# Altium project 工控主板.PrjPcb
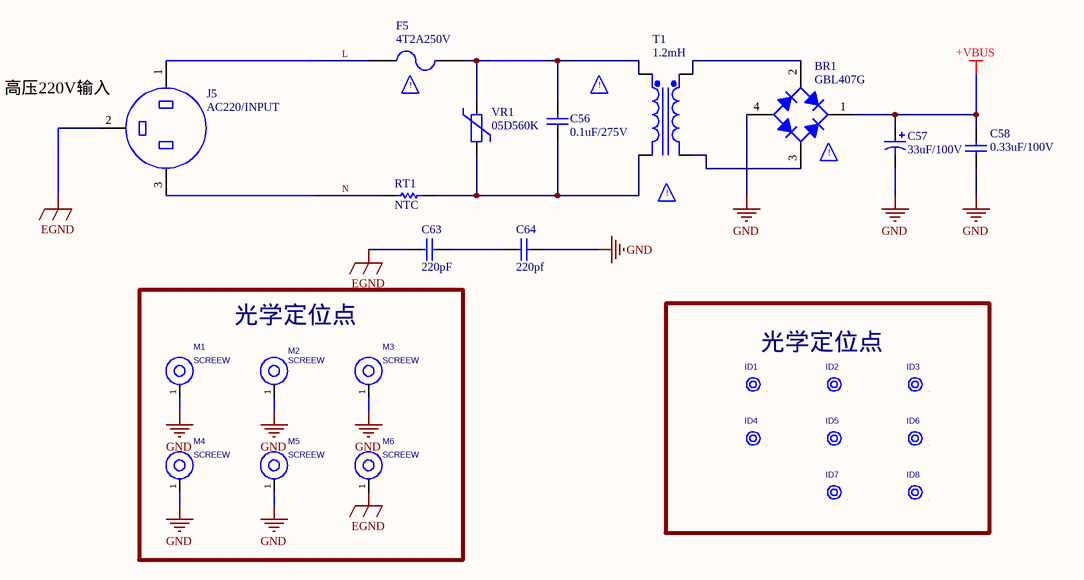
[diagram p0: 01-POWER AC-DC.SchDoc]
5 sheets, 163 parts. Net scope: global (net labels, ports and power ports of the same name join across sheets).
Board file: 工控主板.PcbDoc
Sheets:
  01-POWER AC-DC.SchDoc
  02-POWER DC-DC.SchDoc
  03-CPU Core.SchDoc
  04-lnterface1.SchDoc
  05-lnterface2.SchDoc

## Sheet 01-POWER AC-DC.SchDoc
size A4; SheetNumber: 2; SheetTotal: 6; SPICEModelCacheOUJAJSNC: <root> / <DocumentId>OUJAJSNC</DocumentId> / </root>

### Parts
BR1  GBL407G  [GBL407G]
C56  value 0.1uF/275V  [CBB62-275VAC-104K]  (hidden comment: Cap)
C57  33uF/100V  [CE16250SH1]
C58  value 0.33uF/100V  [AF334J1J079L270D9H]  (hidden comment: Cap)
C63  value 220pF  [C0805]  (hidden comment: Cap)
C64  value 220pf  [C0805]  (hidden comment: Cap)
F5  Fuse 2  [4T2A250V]  (value not drawn)
ID1  LOC  [MARK_1]  (value not drawn)
ID2  LOC  [MARK_1]  (value not drawn)
ID3  LOC  [MARK_1]  (value not drawn)
ID4  LOC  [MARK_1]  (value not drawn)
ID5  LOC  [MARK_1]  (value not drawn)
ID6  LOC  [MARK_1]  (value not drawn)
ID7  LOC  [MARK_1]  (value not drawn)
ID8  LOC  [MARK_1]  (value not drawn)
J5  AC220/INPUT  [VH-3A]
M1  value SCREEW  [SCREEW]  (hidden comment: MARK_4)
M2  value SCREEW  [SCREEW]  (hidden comment: MARK_4)
M3  value SCREEW  [SCREEW]  (hidden comment: MARK_4)
M4  value SCREEW  [SCREEW]  (hidden comment: MARK_4)
M5  value SCREEW  [SCREEW]  (hidden comment: MARK_4)
M6  value SCREEW  [SCREEW]  (hidden comment: MARK_4)
RT1  NTC  [NTC-10D9]
T1  1.2mH  [UU1014]
VR1  05D560K  [RUEF400]

### Blocks framed on the sheet
光学定位点: M1-M6
光学定位点: ID1-ID8

### Nets
+VBUS: BR1.1(K) C57.1 C58.2
EGND: C63.1 J5.2 M6.1
GND: BR1.4(A) C57.2 C58.1 C64.2 M1.1 M2.1 M3.1 M4.1 M5.1  [project net +5V]
L: F5.1 J5.1
N: J5.3 RT1.1
NetBR1_2: BR1.2(C) T1.3(Sec+)
NetBR1_3: BR1.3(C) T1.4(Sec-)
NetC56_1: C56.1 F5.2 T1.1(Pri+) VR1.2
NetC56_2: C56.2 RT1.2 T1.2(Pri-) VR1.1
NetC63_2: C63.2 C64.1

Not connected (* = marked no-connect by the designer): ID1 1; ID2 1; ID3 1; ID4 1; ID5 1; ID6 1; ID7 1; ID8 1

### Notes on the sheet
- (near J5) 高压220V输入
- (near F5) !
- !
- (near T1) !
- (near BR1) !
- (in symbol Fuse 2) 4T2A250V

### Library data of the parts
BR1 = Bridge1: Full Wave Diode Bridge; Published: 8-Jun-2000; LatestRevisionDate: 17-Jul-2002; LatestRevisionNote: Re-released for DXP Platform.; Publisher: Altium Limited
C56 C58 C63 C64 = Cap: Capacitor; Published: 8-Jun-2000; LatestRevisionDate: 17-Jul-2002; LatestRevisionNote: Re-released for DXP Platform.; Publisher: Altium Limited
C57 = Cap Pol1: Polarized Capacitor (Radial); Published: 8-Jun-2000; LatestRevisionDate: 17-Jul-2002; LatestRevisionNote: Re-released for DXP Platform.; Publisher: Altium Limited; Value: 33uF/100V
F5 = Fuse 2: Fuse; Published: 8-Jun-2000; LatestRevisionDate: 17-Jul-2002; LatestRevisionNote: Re-released for DXP Platform.; Publisher: Altium Limited
ID1-ID8 = LOC: SMT_Locotion; PCB DECAL: MARK
M1-M6 = MARK_4: MARK Symble; RK_PN: MARK01; Priority: A; Created_by: CZD; Source_Path: C:\USERS\STQ\DESKTOP\RK3399_BOX\RK3399_BOX_SCH_V1.0_20180521.DSN; Part_Type: MARK; PCB DECAL: MARK
RT1 = Res1: Resistor; Value: 1K; Published: 8-Jun-2000; LatestRevisionDate: 17-Jul-2002; LatestRevisionNote: Re-released for DXP Platform.; Publisher: Altium Limited
T1 = Trans Eq: Transformer (Equivalent Circuit Model); Published: 8-Jun-2000; LatestRevisionDate: 17-Jul-2002; LatestRevisionNote: Re-released for DXP Platform.; Publisher: Altium Limited
VR1 = VR 561K

## Sheet 02-POWER DC-DC.SchDoc
size A4; SheetNumber: 3; SheetTotal: 6; SPICEModelCacheXRWPUVAV: <root> / <DocumentId>XRWPUVAV</DocumentId> / </root>
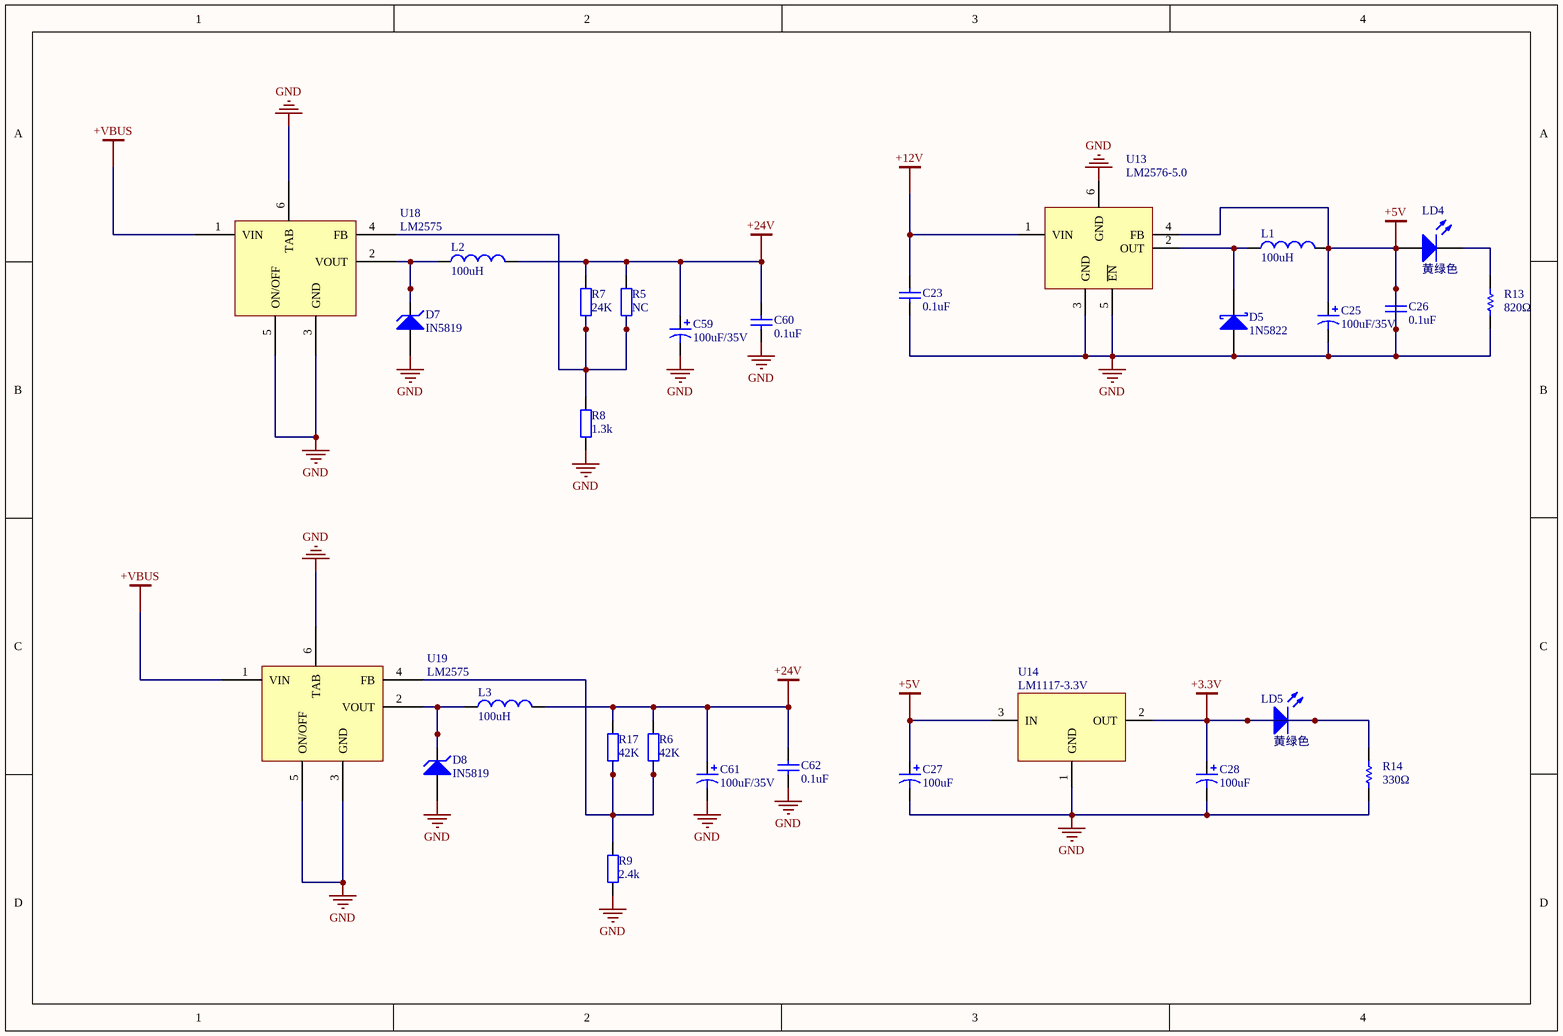
[diagram p1: 02-POWER DC-DC.SchDoc]

### Parts
C23  value 0.1uF  [C0805]  (hidden comment: Cap)
C25  value 100uF/35V  [SMD-6.3-7.7]  (hidden comment: Cap Pol2)
C26  value 0.1uF  [C0805]  (hidden comment: Cap)
C27  value 100uF  [SMD-6.3-7.7]  (hidden comment: Cap Pol2)
C28  value 100uF  [SMD-6.3-7.7]  (hidden comment: Cap Pol2)
C59  value 100uF/35V  [SMD-6.3-7.7]  (hidden comment: Cap Pol2)
C60  value 0.1uF  [C0805]  (hidden comment: Cap)
C61  value 100uF/35V  [SMD-6.3-7.7]  (hidden comment: Cap Pol2)
C62  value 0.1uF  [C0805]  (hidden comment: Cap)
D5  1N5822  [SMA-L4]
D7  IN5819  [SMA-L4]
D8  IN5819  [SMA-L4]
L1  value 100uH  [L100uH]  (hidden comment: Inductor)
L2  value 100uH  [L100uH]  (hidden comment: Inductor)
L3  value 100uH  [L100uH]  (hidden comment: Inductor)
LD4  黄绿色  [LED0805]
LD5  黄绿色  [LED0805]
R5  value NC  [R0805]  (hidden comment: Res2)
R6  value 42K  [R0805]  (hidden comment: Res2)
R7  value 24K  [R0805]  (hidden comment: Res2)
R8  value 1.3k  [R0805]  (hidden comment: Res2)
R9  value 2.4k  [R0805]  (hidden comment: Res2)
R13  value 820Ω  [NTC-10D9]
R14  value 330Ω  [NTC-10D9]
R17  value 42K  [R0805]  (hidden comment: Res2)
U13  LM2576-5.0  [TO-263-5]
U14  LM1117-3.3V  [SOT-223]
U18  LM2575  [TO-263-5]
U19  LM2575  [TO-263-5]

### Nets
+3.3V: C28.1 LD5.1(A) LD5.2(K) R14.2 U14.2(OUT)
+5V: C23.1 C25.1 C25.2 C26.1 C26.2 C27.1 C27.2 C28.2 C59.2 C60.1 C61.2 C62.1 D5.2(A) D7.1(A) D8.1(A) L1.2 LD4.1(A) R8.2 R9.2 R13.1 R14.1 U13.3(GND) U13.4(FB) U13.5(~{EN}) U13.6(GND) U14.1(GND) U14.3(IN) U18.3(GND) U18.5(ON/OFF) U18.6(TAB) U19.3(GND) U19.5(ON/OFF) U19.6(TAB)  [also labelled GND]
+12V: C23.2 U13.1(VIN)
+24V: C59.1 C60.2 C61.1 C62.2 L2.2 L3.2 R5.1 R6.1 R7.2 R17.2
+VBUS: U18.1(VIN) U19.1(VIN)
NetD5_1: D5.1(K) L1.1 U13.2(OUT)
NetD7_2: D7.2(K) L2.1 U18.2(VOUT)
NetD8_2: D8.2(K) L3.1 U19.2(VOUT)
NetLD4_2: LD4.2(K) R13.2
NetR5_2: R5.2 R7.1 R8.1 U18.4(FB)
NetR6_2: R6.2 R9.1 R17.1 U19.4(FB)

### Library data of the parts
C23 C26 C60 C62 = Cap: Capacitor; Published: 8-Jun-2000; LatestRevisionDate: 17-Jul-2002; LatestRevisionNote: Re-released for DXP Platform.; Publisher: Altium Limited
C25 C27 C28 C59 C61 = Cap Pol2: Polarized Capacitor (Axial); Published: 8-Jun-2000; LatestRevisionDate: 17-Jul-2002; LatestRevisionNote: Re-released for DXP Platform.; PackageReference: POLAR0.8; Publisher: Altium Limited; PackageDescription: Polarized Capacitor; 2 Leads
D5 = Diode 10TQ035: Schottky Rectifier; Note: Terminal 2 is the TAB and is electrically connected to the cathode; Published: 8-Jun-2000; LatestRevisionDate: 17-Jul-2002; LatestRevisionNote: Re-released for DXP Platform.; DatasheetDocument: PD-2.057B; PackageDocument: Feb-1998; PackageReference: TO-220AC; Publisher: Altium Limited
D7 D8 = D Zener: Zener Diode; Published: 8-Jun-2000; LatestRevisionDate: 17-Jul-2002; LatestRevisionNote: Re-released for DXP Platform.; PackageReference: DIODE-0.7; Publisher: Altium Limited; PackageDescription: Diode, Thru-Hole; 2 Leads; 0.7 in Pin Spacing
L1-L3 = Inductor: Code_IEC: 1005; Published: 8-Jun-2000; LatestRevisionDate: 17-Jul-2002; LatestRevisionNote: Re-released for DXP Platform.; PackageReference: 0402-A; Publisher: Altium Limited; Code_JEITA: 0402
LD4 LD5 = LED0: Typical INFRARED GaAs LED; Published: 8-Jun-2000; LatestRevisionDate: 17-Jul-2002; LatestRevisionNote: Re-released for DXP Platform.; Publisher: Altium Limited
R5-R9 R17 = Res2: Resistor; Published: 8-Jun-2000; LatestRevisionDate: 17-Jul-2002; LatestRevisionNote: Re-released for DXP Platform.; PackageReference: AXIAL-0.4; Publisher: Altium Limited; PackageDescription: Axial Device, Thru-Hole; 2 Leads; 0.4 in Pin Spacing
R13 R14 = Res1: Resistor; Published: 8-Jun-2000; LatestRevisionDate: 17-Jul-2002; LatestRevisionNote: Re-released for DXP Platform.; Publisher: Altium Limited
U14 = LM1117

## Sheet 03-CPU Core.SchDoc
size A2; SheetNumber: 4; SheetTotal: 6; SPICEModelCacheQEJGZIRO: <root> / <DocumentId>QEJGZIRO</DocumentId> / <CacheFrame Number="0"> / <Model Name="diode" Kind="MDL"> / <Text>*Default Diode / *Diode Pinout: A,K / .MODEL DIODE D()</Text> / </Model> / <Model Name="xtal" Kind="CKT"> / <Text>*Generic type:crystal pkg:HC33/51 / .SUBCKT XTAL 1 2 PARAMS: FREQ=1Meg RS=750 C=13pf Q=1000 / LX 1 3 {((Q*RS)/(6.2831852*FREQ))} IC=0.5M / CX 3 4 {(1/(Q*6.2831852*FREQ*RS))} / C0 1 2 {C} / RS 4 2 {RS} / .ENDS XTAL</Text> / </Model> / <Model Name="led0" Kind="MDL"> / <Text>*Typ INFRARED GaAs LED: Vf=1.2V Vr=5V If=40mA trr=3uS / *LED Pinout: 1=A, 2=K / .MODEL LED0 D (IS=93.5P RS=84M N=2.63 BV=5 IBV=10U / + CJO=2.97P VJ=.75 M=.333 TT=4.32U)</Text> / </Model> / </CacheFrame> / </root>
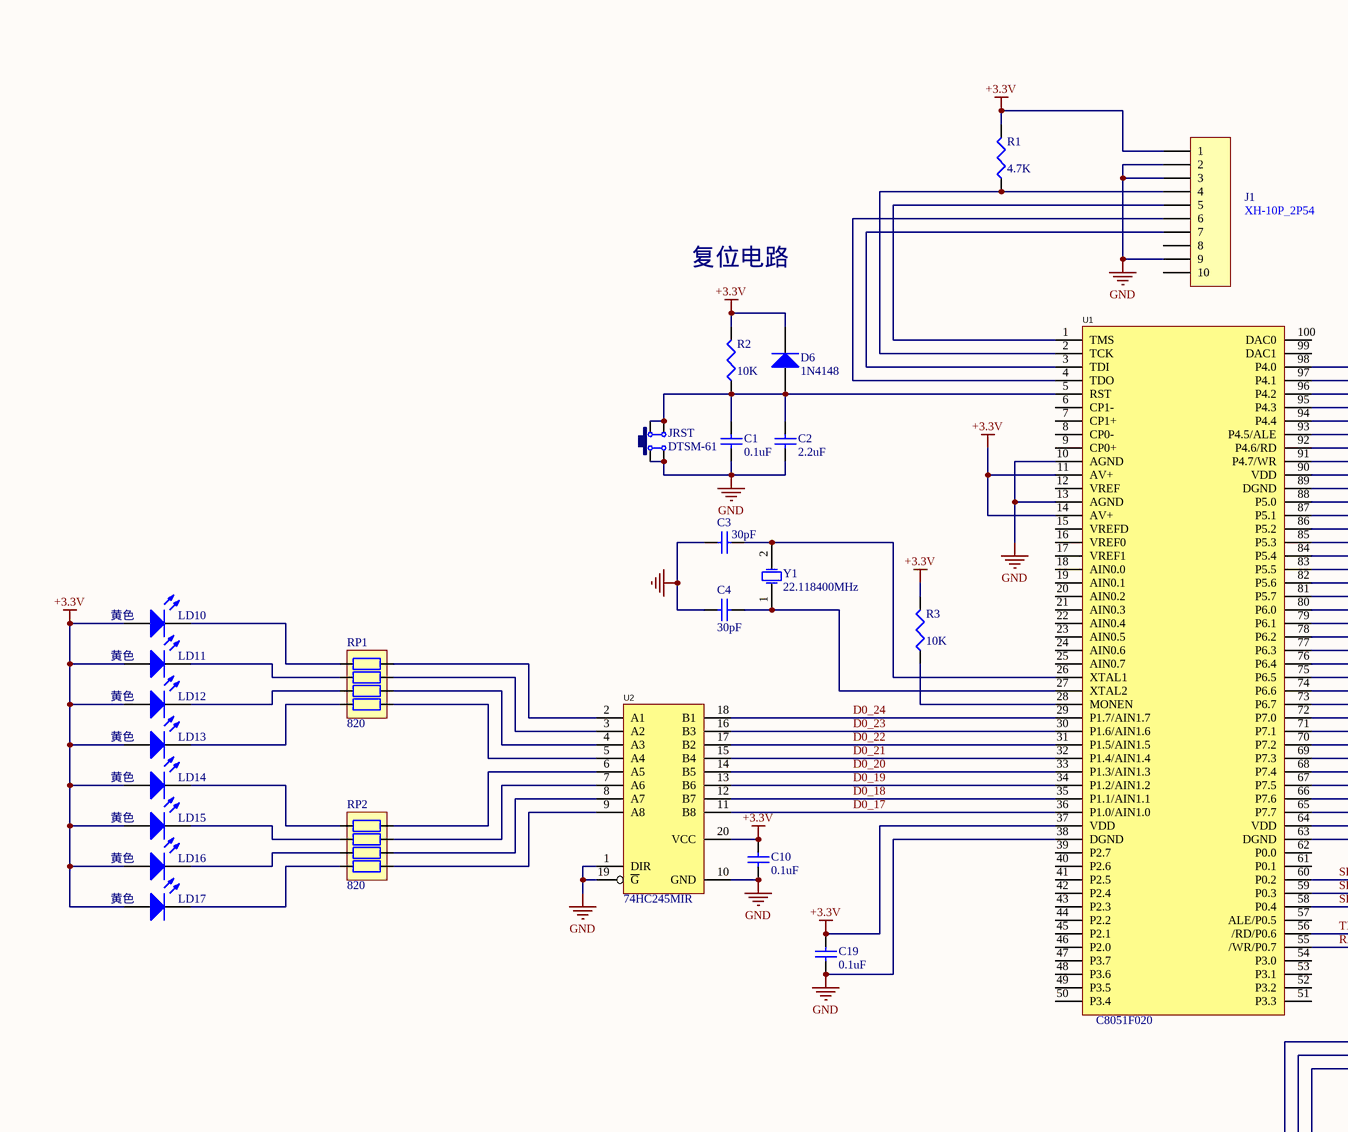
[diagram p2: 03-CPU Core.SchDoc, left]
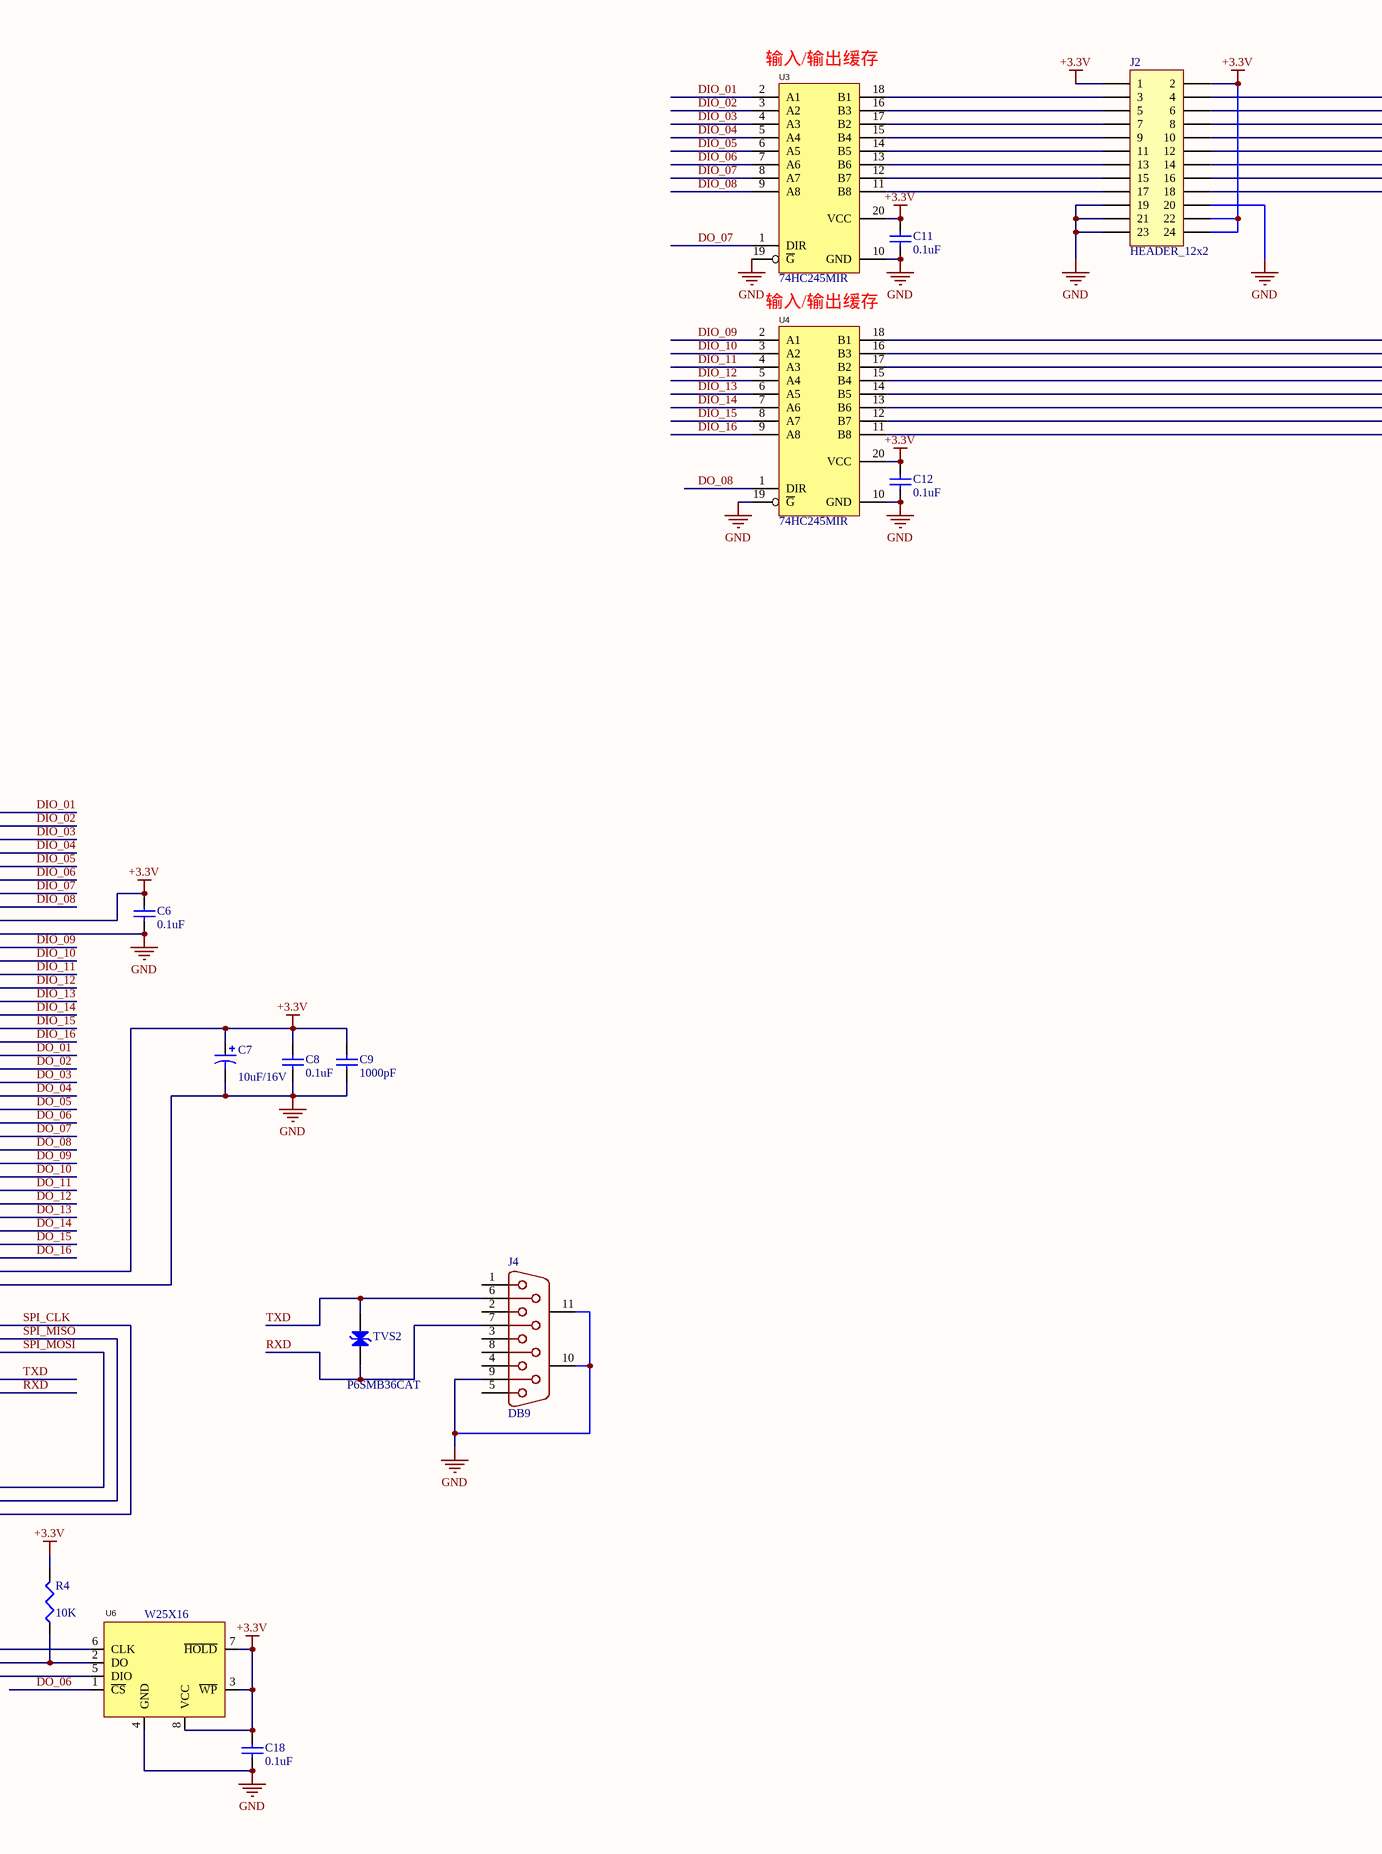
[diagram p3: 03-CPU Core.SchDoc, right]

### Parts
C1  value 0.1uF  [C0805]  (hidden comment: Cap)
C2  value 2.2uF  [C0805]  (hidden comment: Cap)
C3  value 30pF  [C0805]  (hidden comment: Cap)
C4  value 30pF  [C0805]  (hidden comment: Cap)
C6  value 0.1uF  [C0805]  (hidden comment: Cap)
C7  value 10uF/16V  [C3216]  (hidden comment: Cap Pol1)
C8  value 0.1uF  [C0805]  (hidden comment: Cap)
C9  value 1000pF  [C0805]  (hidden comment: Cap)
C10  value 0.1uF  [C0805]  (hidden comment: Cap)
C11  value 0.1uF  [C0805]  (hidden comment: Cap)
C12  value 0.1uF  [C0805]  (hidden comment: Cap)
C18  value 0.1uF  [C0805]  (hidden comment: Cap)
C19  value 0.1uF  [C0805]  (hidden comment: Cap)
D6  1N4148  [FR107W]
J1  XH-10P_2P54  [XH-10P_2P54]  (value not drawn)
J2  HEADER_12x2  [HEADER_12x2]
J4  DB9  [DB9]
JRST  DTSM-61  [DISM-61]
LD10  黄色  [LED0805]
LD11  黄色  [LED0805]
LD12  黄色  [LED0805]
LD13  黄色  [LED0805]
LD14  黄色  [LED0805]
LD15  黄色  [LED0805]
LD16  黄色  [LED0805]
LD17  黄色  [LED0805]
R1  value 4.7K  [R0805]  (hidden comment: Res3)
R2  value 10K  [R0805]  (hidden comment: Res3)
R3  value 10K  [R0805]  (hidden comment: Res3)
R4  value 10K  [R0805]  (hidden comment: Res3)
RP1  820  [RP]
RP2  820  [RP]
TVS2  P6SMB36CAT  [TVS]
U1  C8051F020  [TQFP-100]
U2  74HC245MIR  [SSOP-20]
U3  74HC245MIR  [SSOP-20]
U4  74HC245MIR  [SSOP-20]
U6  W25X16  [SOIC-8]
Y1  22.118400MHz  [HC-49]

### Nets
+3.3V: C6.2 C7.1 C8.2 C9.2 C10.2 C11.2 C12.2 C18.2 C19.2 D6.2(K) J1.1 J2.1 J2.2 J2.22 J2.24 LD10.1(A) LD11.1(A) LD12.1(A) LD13.1(A) LD14.1(A) LD15.1(A) LD16.1(A) LD17.1(A) R1.2 R2.2 R3.2 R4.2 U1.11(AV+) U1.14(AV+) U1.37(VDD) U1.64(VDD) U1.90(VDD) U2.20(VCC) U3.20(VCC) U4.20(VCC) U6.3(~{WP}) U6.7(~{HOLD}) U6.8(VCC)
GND: C1.2 C2.2 C3.1 C4.1 C6.1 C7.2 C8.1 C9.1 C10.1 C11.1 C12.1 C18.1 C19.1 J1.2 J1.3 J1.9 J2.19 J2.20 J2.21 J2.23 J4.9 J4.10(MH1) J4.11(MH2) JRST.1 JRST.4 U1.10(AGND) U1.13(AGND) U1.38(DGND) U1.63(DGND) U1.89(DGND) U2.1(DIR) U2.10(GND) U2.19(~{G}) U3.10(GND) U3.19(~{G}) U4.10(GND) U4.19(~{G}) U6.4(GND)  [project net +5V]
D0_17: U1.36(P1.0/AIN1.0) U2.11(B8)
D0_18: U1.35(P1.1/AIN1.1) U2.12(B7)
D0_19: U1.34(P1.2/AIN1.2) U2.13(B6)
D0_20: U1.33(P1.3/AIN1.3) U2.14(B5)
D0_21: U1.32(P1.4/AIN1.4) U2.15(B4)
D0_22: U1.31(P1.5/AIN1.5) U2.17(B2)
D0_23: U1.30(P1.6/AIN1.6) U2.16(B3)
D0_24: U1.29(P1.7/AIN1.7) U2.18(B1)
DIO_01: U1.98(P4.0) U3.2(A1)
DIO_02: U1.97(P4.1) U3.3(A2)
DIO_03: U1.96(P4.2) U3.4(A3)
DIO_04: U1.95(P4.3) U3.5(A4)
DIO_05: U1.94(P4.4) U3.6(A5)
DIO_06: U1.93(P4.5/ALE) U3.7(A6)
DIO_07: U1.92(P4.6/RD) U3.8(A7)
DIO_08: U1.91(P4.7/WR) U3.9(A8)
DIO_09: U1.88(P5.0) U4.2(A1)
DIO_10: U1.87(P5.1) U4.3(A2)
DIO_11: U1.86(P5.2) U4.4(A3)
DIO_12: U1.85(P5.3) U4.5(A4)
DIO_13: U1.84(P5.4) U4.6(A5)
DIO_14: U1.83(P5.5) U4.7(A6)
DIO_15: U1.82(P5.6) U4.8(A7)
DIO_16: U1.81(P5.7) U4.9(A8)
DO_01: U1.80(P6.0)
DO_02: U1.79(P6.1)
DO_03: U1.78(P6.2)
DO_04: U1.77(P6.3)
DO_05: U1.76(P6.4)
DO_06: U1.75(P6.5) U6.1(~{CS})
DO_07: U1.74(P6.6) U3.1(DIR)
DO_08: U1.73(P6.7) U4.1(DIR)
DO_09: U1.72(P7.0)
DO_10: U1.71(P7.1)
DO_11: U1.70(P7.2)
DO_12: U1.69(P7.3)
DO_13: U1.68(P7.4)
DO_14: U1.67(P7.5)
DO_15: U1.66(P7.6)
DO_16: U1.65(P7.7)
RXD: J4.7 TVS2.2(K) U1.55(/WR/P0.7)
SPI_CLK: U1.60(P0.2) U6.6(CLK)
SPI_MISO: R4.1 U1.59(P0.3) U6.2(DO)
SPI_MOSI: U1.58(P0.4) U6.5(DIO)
TXD: J4.6 TVS2.1(A) U1.56(/RD/P0.6)
NetC1_1: C1.1 C2.1 D6.1(A) JRST.2 JRST.3 R2.1 U1.5(RST)
NetC3_2: C3.2 U1.26(XTAL1) Y1.2(OSC2)
NetC4_2: C4.2 U1.27(XTAL2) Y1.1(OSC1)
NetJ1_4: J1.4 R1.1 U1.2(TCK)
NetJ1_5: J1.5 U1.1(TMS)
NetJ1_6: J1.6 U1.4(TDO)
NetJ1_7: J1.7 U1.3(TDI)
NetJ2_3: J2.3 U3.18(B1)
NetJ2_4: J2.4 U4.18(B1)
NetJ2_5: J2.5 U3.16(B3)
NetJ2_6: J2.6 U4.16(B3)
NetJ2_7: J2.7 U3.17(B2)
NetJ2_8: J2.8 U4.17(B2)
NetJ2_9: J2.9 U3.15(B4)
NetJ2_10: J2.10 U4.15(B4)
NetJ2_11: J2.11 U3.14(B5)
NetJ2_12: J2.12 U4.14(B5)
NetJ2_13: J2.13 U3.13(B6)
NetJ2_14: J2.14 U4.13(B6)
NetJ2_15: J2.15 U3.12(B7)
NetJ2_16: J2.16 U4.12(B7)
NetJ2_17: J2.17 U3.11(B8)
NetJ2_18: J2.18 U4.11(B8)
NetLD10_2: LD10.2(K) RP1.1
NetLD11_2: LD11.2(K) RP1.2
NetLD12_2: LD12.2(K) RP1.3
NetLD13_2: LD13.2(K) RP1.4
NetLD14_2: LD14.2(K) RP2.1
NetLD15_2: LD15.2(K) RP2.2
NetLD16_2: LD16.2(K) RP2.3
NetLD17_2: LD17.2(K) RP2.4
NetR3_1: R3.1 U1.28(MONEN)
NetRP1_5: RP1.5 U2.5(A4)
NetRP1_6: RP1.6 U2.4(A3)
NetRP1_7: RP1.7 U2.3(A2)
NetRP1_8: RP1.8 U2.2(A1)
NetRP2_5: RP2.5 U2.9(A8)
NetRP2_6: RP2.6 U2.8(A7)
NetRP2_7: RP2.7 U2.7(A6)
NetRP2_8: RP2.8 U2.6(A5)

Not connected (* = marked no-connect by the designer): J1 8 10; J4 1 2 3 4 5 8; U1 6(CP1-) 7(CP1+) 8(CP0-) 9(CP0+) 12(VREF) 15(VREFD) 16(VREF0) 17(VREF1) 18(AIN0.0) 19(AIN0.1) 20(AIN0.2) 21(AIN0.3) 22(AIN0.4) 23(AIN0.5) 24(AIN0.6) 25(AIN0.7) 39(P2.7) 40(P2.6) 41(P2.5) 42(P2.4) 43(P2.3) 44(P2.2) 45(P2.1) 46(P2.0) 47(P3.7) 48(P3.6) 49(P3.5) 50(P3.4) 51(P3.3) 52(P3.2) 53(P3.1) 54(P3.0) 57(ALE/P0.5) 61(P0.1) 62(P0.0) 99(DAC1) 100(DAC0)

### Notes on the sheet
- (near U3) 输入/输出缓存
- 输入/输出缓存
- XH-10P_2P54
- 复位电路

### Library data of the parts
C1-C4 C6 C8-C12 C18 C19 = Cap: Capacitor; Published: 8-Jun-2000; LatestRevisionDate: 17-Jul-2002; LatestRevisionNote: Re-released for DXP Platform.; PackageReference: RAD-0.3; Publisher: Altium Limited; PackageDescription: Radial Cap, Thru-Hole; 2 Leads; 0.3 in Pin Spacing
C7 = Cap Pol1: Polarized Capacitor (Radial); Published: 8-Jun-2000; LatestRevisionDate: 17-Jul-2002; LatestRevisionNote: Re-released for DXP Platform.; PackageReference: RB7.6-15; Publisher: Altium Limited; PackageDescription: Polarized Capacitor (Radial); 2 Leads
D6 = Diode: Default Diode; Published: 8-Jun-2000; LatestRevisionDate: 17-Jul-2002; LatestRevisionNote: Re-released for DXP Platform.; PackageVersion: Sep-1996; PackageReference: SMC; Publisher: Altium Limited; PackageDescription: DO-214-AB/SMC; 2 C-Bend Leads; Body 7.9 x 5.9 mm, inc. leads (LxW); Code_JEDEC: DO-214-AB
J1 = Header 10: Header, 10-Pin; LatestRevisionDate: 17-Jul-2002; LatestRevisionNote: Re-released for DXP Platform.; Publisher: Altium Limited
J2 = Header 12X2: Header, 12-Pin, Dual row; LatestRevisionDate: 17-Jul-2002; LatestRevisionNote: Re-released for DXP Platform.; Publisher: Altium Limited
LD10-LD17 = LED0: Typical INFRARED GaAs LED; Published: 8-Jun-2000; LatestRevisionDate: 08-Jul-2005; LatestRevisionNote: Mech Layer 1 removed.; PackageReference: LED-0; Publisher: Altium Limited; PackageDescription: LED; 2 Leads
R1-R4 = Res3: Resistor; Published: 8-Jun-2000; LatestRevisionDate: 29-May-2009; LatestRevisionNote: IPC-7351 Footprint Added.; PackageReference: J1-0603; Publisher: Altium Limited; PackageDescription: Chip Resistor
RP1 RP2 = RP 820
TVS2 = SMD
U1 = C8051F020: Manufacturer: SKYWORKS/SILICON LABS(芯科); Symbol: C8051F020-GQR; Add into BOM: yes; CPU Core: 51系列; Program Storage Size: 64KB; GPIO Ports Number: 64; Operating Voltage Range: 2.7V~3.6V; CPU Maximum Speed: 25MHz; ADC (Bit): 12bit；8bit; DAC (Bit): 12bit; Peripheral/Function: 温度传感器; Watchdog: 有; Device: C8051F020-GQR; LCSC Part Name: C8051F020-GQR; Supplier Part: C18087; Manufacturer Part: C8051F020-GQR; Supplier Footprint: TQFP-100(14x14); JLCPCB Part Class: Extended Part; Datasheet: https://atta.szlcsc.com/upload/public/pdf/source/20160318/1458266986324.pdf; Supplier: LCSC; Convert to PCB: yes; Operating Temperature Range: -40℃~+85℃; Universal Serial Bus: -; Low-Voltage Detect: 有; Secure Digital Input and Output: -; Internal Oscillator: 有
U2-U4 = 74HC245MIR: Manufacturer: Nexperia(安世); Symbol: 74HC245PW,118; Add into BOM: yes; output type: 三态; Supply Voltage: 2V~6V; Number of Elements: 1; Number of Bits per Element: 8; Sink Current: 7.8mA; Logic Family: 74HC; Device: 74HC245PW,118; LCSC Part Name: 74HC245PW,118; Supplier Part: C5626; Manufacturer Part: 74HC245PW,118; Supplier Footprint: TSSOP-20; JLCPCB Part Class: Extended Part; Datasheet: https://atta.szlcsc.com/upload/public/pdf/source/20180326/C70245_56281BCF84F9E7641D2BBB6A629E618A.pdf; Supplier: LCSC; Convert to PCB: yes; Input type: -; Channel Type: -; Source Current: 7.8mA; Operating Temperature: -40℃~+125℃
U6 = W25X16: Manufacturer: WINBOND(华邦); Symbol: W25X16VSSIG; Add into BOM: yes; Device: W25X16VSSIG; Supplier: LCSC; Supplier Part: C13586; Manufacturer Part: W25X16VSSIG; JLCPCB Part Class: Extended Part; LCSC Part Name: W25X16VSSIG 停产; Supplier Footprint: SOIC-8-208mil; Datasheet: https://atta.szlcsc.com/upload/public/pdf/source/20130607/1457706608717.pdf; Convert to PCB: yes
Y1 = XTAL: Crystal Oscillator; Published: 8-Jun-2000; LatestRevisionDate: 17-Jul-2002; LatestRevisionNote: Re-released for DXP Platform.; PackageReference: R38; Publisher: Altium Limited; PackageDescription: Crystal, Thru-Hole; 2 Leads; Body 3.1 x 8.2 mm (Dia.xH)

## Sheet 04-lnterface1.SchDoc
size A3; SheetNumber: 5; SheetTotal: 6
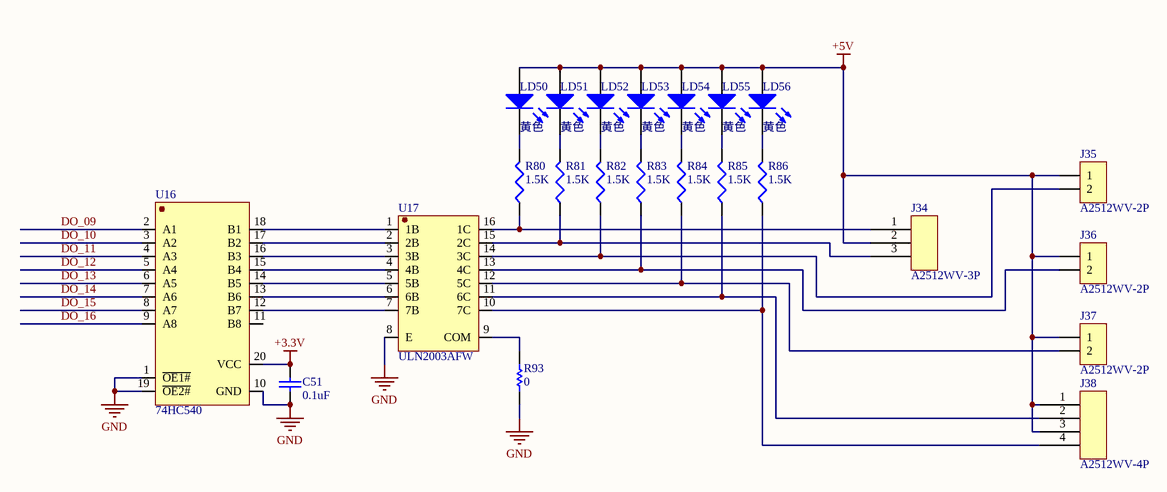
[diagram p4: 04-lnterface1.SchDoc]

### Parts
C51  value 0.1uF  [C0805]  (hidden comment: Cap)
J34  A2512WV-3P  [A2512WV-3P]
J35  A2512WV-2P  [A2512WV-2P]
J36  A2512WV-2P  [A2512WV-2P]
J37  A2512WV-2P  [A2512WV-2P]
J38  A2512WV-4P  [A2512WV-4P]
LD50  黄色  [LED0805]
LD51  黄色  [LED0805]
LD52  黄色  [LED0805]
LD53  黄色  [LED0805]
LD54  黄色  [LED0805]
LD55  黄色  [LED0805]
LD56  黄色  [LED0805]
R80  value 1.5K  [R0805]  (hidden comment: Res3)
R81  value 1.5K  [R0805]  (hidden comment: Res3)
R82  value 1.5K  [R0805]  (hidden comment: Res3)
R83  value 1.5K  [R0805]  (hidden comment: Res3)
R84  value 1.5K  [R0805]  (hidden comment: Res3)
R85  value 1.5K  [R0805]  (hidden comment: Res3)
R86  value 1.5K  [R0805]  (hidden comment: Res3)
R93  0  [R0805]
U16  74HC540  [SOP-20]
U17  ULN2003AFW  [SO-16P]

### Nets
+3.3V: C51.2 U16.20(VCC)
+5V: C51.1 J34.2 J35.1 J36.1 J37.1 J38.1 J38.3 LD50.1(A) LD51.1(A) LD52.1(A) LD53.1(A) LD54.1(A) LD55.1(A) LD56.1(A) R93.1 U16.1(~{OE1#}) U16.10(GND) U16.19(~{OE2#}) U17.8(E)  [also labelled GND]
DO_09: U16.2(A1)
DO_10: U16.3(A2)
DO_11: U16.4(A3)
DO_12: U16.5(A4)
DO_13: U16.6(A5)
DO_14: U16.7(A6)
DO_15: U16.8(A7)
DO_16: U16.9(A8)
NetJ34_1: J34.1 R80.1 U17.16(1C)
NetJ34_3: J34.3 R81.1 U17.15(2C)
NetJ35_2: J35.2 R82.1 U17.14(3C)
NetJ36_2: J36.2 R83.1 U17.13(4C)
NetJ37_2: J37.2 R84.1 U17.12(5C)
NetJ38_2: J38.2 R85.1 U17.11(6C)
NetJ38_4: J38.4 R86.1 U17.10(7C)
NetLD50_2: LD50.2(K) R80.2
NetLD51_2: LD51.2(K) R81.2
NetLD52_2: LD52.2(K) R82.2
NetLD53_2: LD53.2(K) R83.2
NetLD54_2: LD54.2(K) R84.2
NetLD55_2: LD55.2(K) R85.2
NetLD56_2: LD56.2(K) R86.2
NetR93_2: R93.2 U17.9(COM)
NetU16_12: U16.12(B7) U17.7(7B)
NetU16_13: U16.13(B6) U17.6(6B)
NetU16_14: U16.14(B5) U17.5(5B)
NetU16_15: U16.15(B4) U17.4(4B)
NetU16_16: U16.16(B3) U17.3(3B)
NetU16_17: U16.17(B2) U17.2(2B)
NetU16_18: U16.18(B1) U17.1(1B)

Not connected (* = marked no-connect by the designer): U16 11(B8)

### Library data of the parts
C51 = Cap: Capacitor; Published: 8-Jun-2000; LatestRevisionDate: 17-Jul-2002; LatestRevisionNote: Re-released for DXP Platform.; Publisher: Altium Limited
LD50-LD56 = LED0: Typical INFRARED GaAs LED; Published: 8-Jun-2000; LatestRevisionDate: 17-Jul-2002; LatestRevisionNote: Re-released for DXP Platform.; Publisher: Altium Limited
R80-R86 = Res3: Resistor; Published: 8-Jun-2000; LatestRevisionDate: 17-Jul-2002; LatestRevisionNote: Re-released for DXP Platform.; Publisher: Altium Limited
R93 = R 1206: ComponentLink1Description: New link; ComponentLink1URL: *; Parameter 1: 0

## Sheet 05-lnterface2.SchDoc
size A3; SheetNumber: 6; SheetTotal: 6
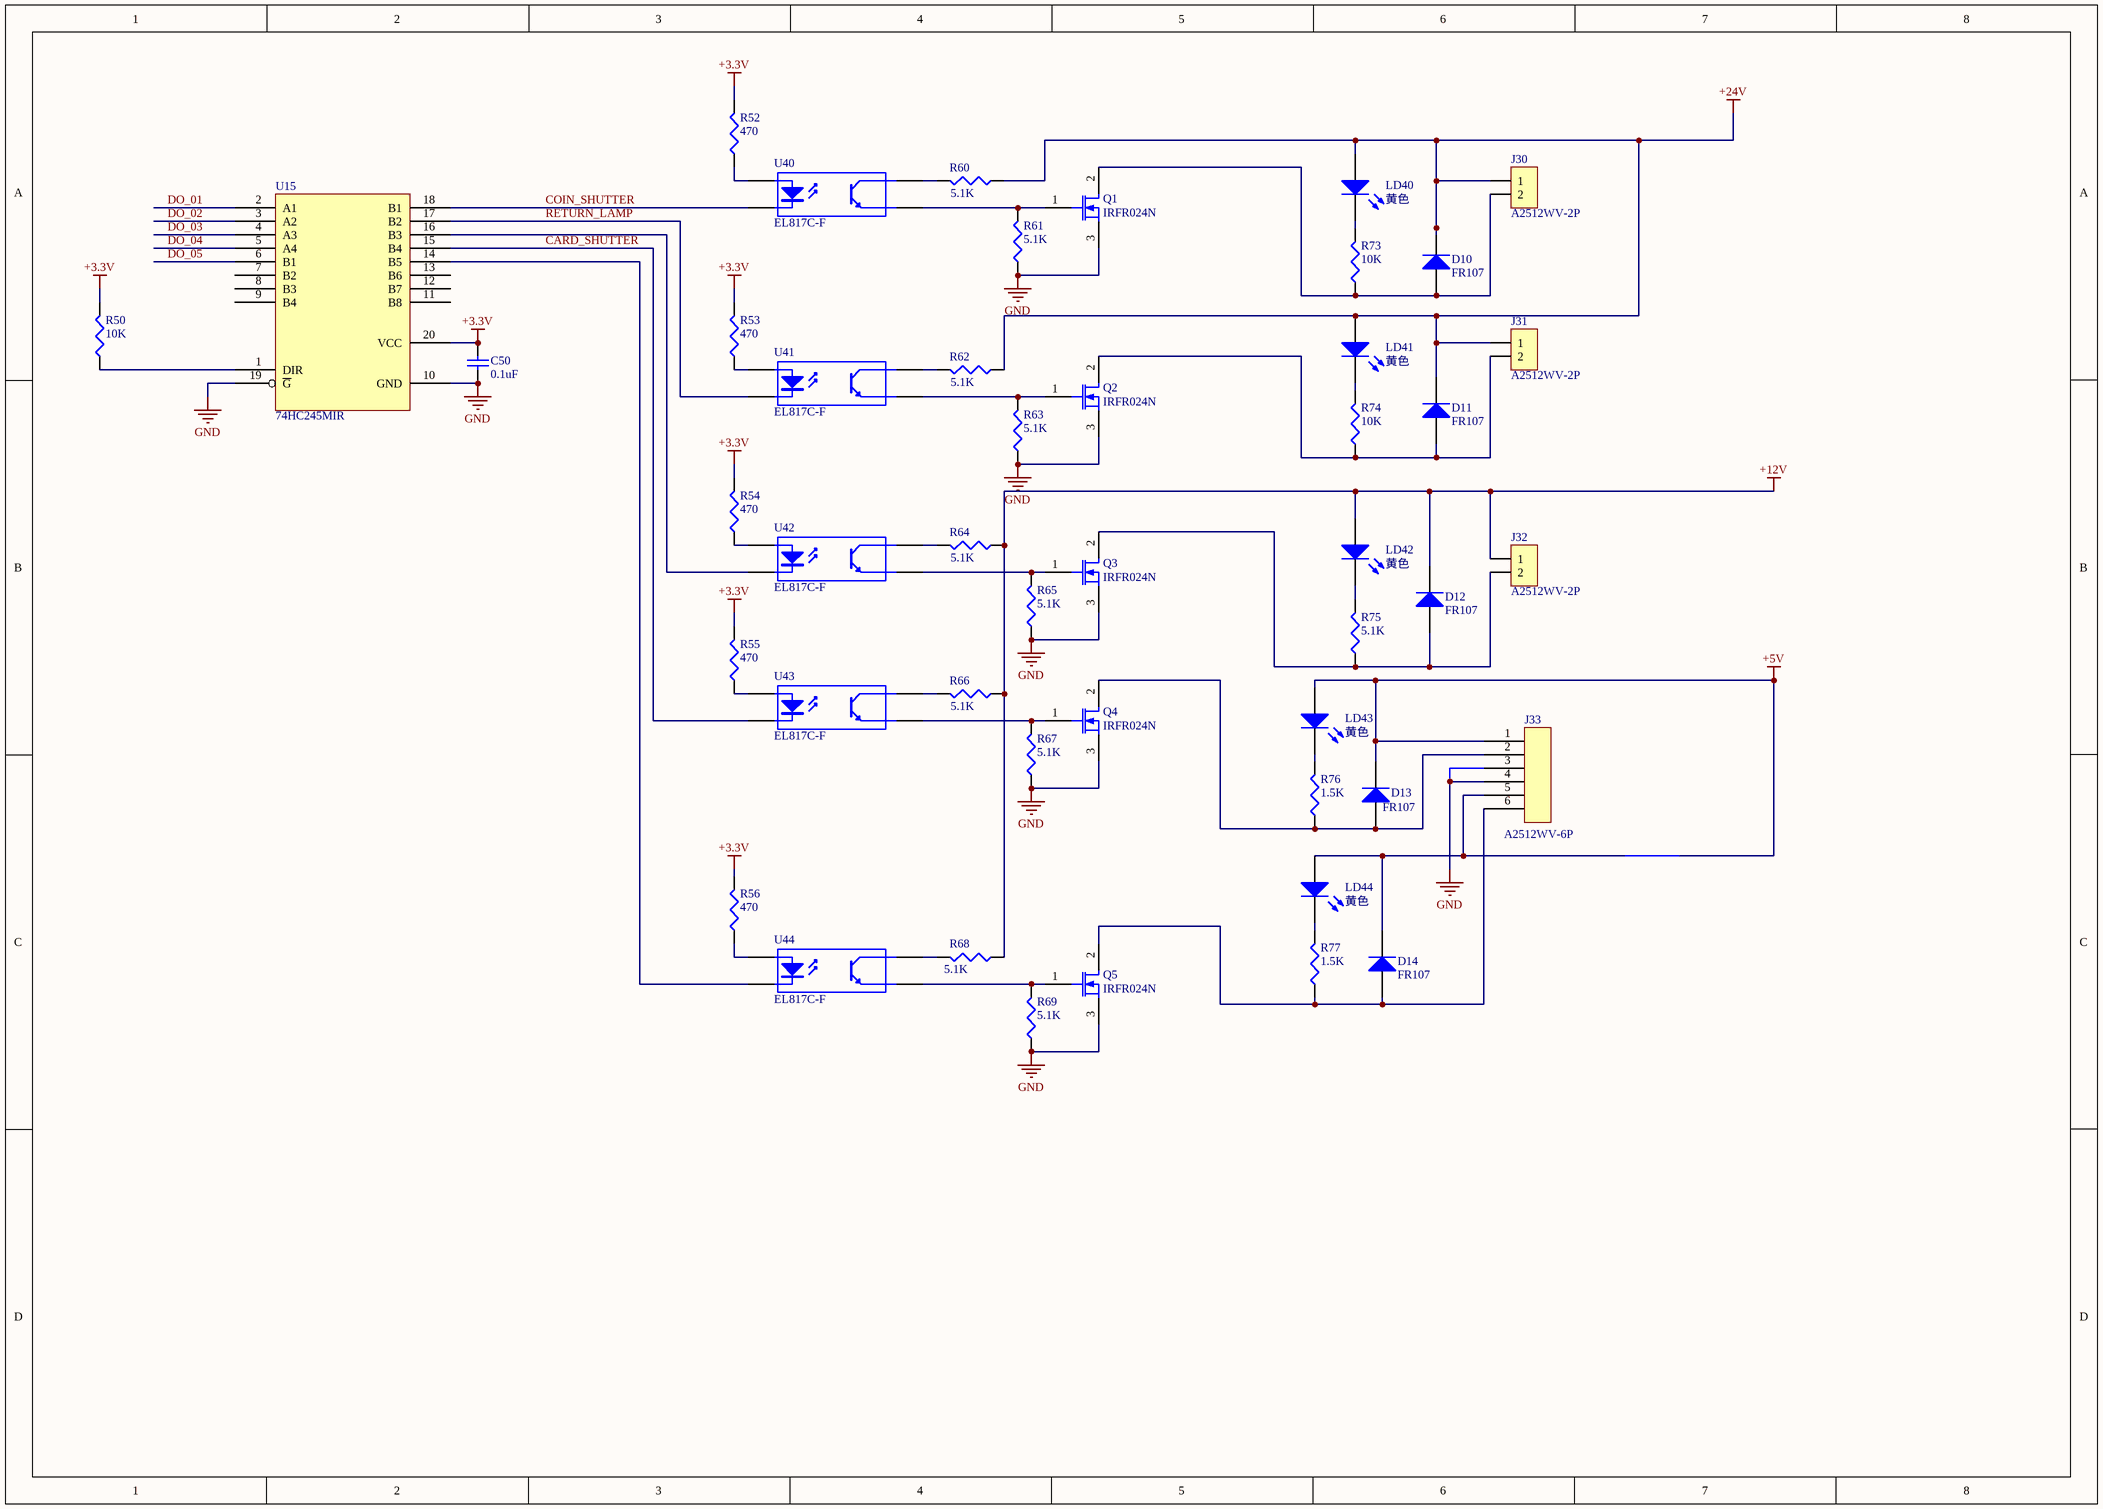
[diagram p5: 05-lnterface2.SchDoc]

### Parts
C50  value 0.1uF  [C0805]  (hidden comment: Cap)
D10  FR107  [FR107W]
D11  FR107  [FR107W]
D12  FR107  [FR107W]
D13  FR107  [FR107W]
D14  FR107  [FR107W]
J30  A2512WV-2P  [A2512WV-2P]
J31  A2512WV-2P  [A2512WV-2P]
J32  A2512WV-2P  [A2512WV-2P]
J33  A2512WV-6P  [A2512WV-6P]
LD40  黄色  [LED0805]
LD41  黄色  [LED0805]
LD42  黄色  [LED0805]
LD43  黄色  [LED0805]
LD44  黄色  [LED0805]
Q1  IRFR024N  [TO-252AA]
Q2  IRFR024N  [TO-252AA]
Q3  IRFR024N  [TO-252AA]
Q4  IRFR024N  [TO-252AA]
Q5  IRFR024N  [TO-252AA]
R50  value 10K  [R0805]  (hidden comment: Res3)
R52  value 470  [R0805]  (hidden comment: Res3)
R53  value 470  [R0805]  (hidden comment: Res3)
R54  value 470  [R0805]  (hidden comment: Res3)
R55  value 470  [R0805]  (hidden comment: Res3)
R56  value 470  [R0805]  (hidden comment: Res3)
R60  value 5.1K  [R0805]  (hidden comment: Res3)
R61  value 5.1K  [R0805]  (hidden comment: Res3)
R62  value 5.1K  [R0805]  (hidden comment: Res3)
R63  value 5.1K  [R0805]  (hidden comment: Res3)
R64  value 5.1K  [R0805]  (hidden comment: Res3)
R65  value 5.1K  [R0805]  (hidden comment: Res3)
R66  value 5.1K  [R0805]  (hidden comment: Res3)
R67  value 5.1K  [R0805]  (hidden comment: Res3)
R68  value 5.1K  [R0805]  (hidden comment: Res3)
R69  value 5.1K  [R0805]  (hidden comment: Res3)
R73  value 10K  [R0805]  (hidden comment: Res3)
R74  value 10K  [R0805]  (hidden comment: Res3)
R75  value 5.1K  [R0805]  (hidden comment: Res3)
R76  value 1.5K  [R0805]  (hidden comment: Res3)
R77  value 1.5K  [R0805]  (hidden comment: Res3)
U15  74HC245MIR  [SSOP-20]
U40  EL817C-F  [DIP-4]
U41  EL817C-F  [DIP-4]
U42  EL817C-F  [DIP-4]
U43  EL817C-F  [DIP-4]
U44  EL817C-F  [DIP-4]

### Nets
+3.3V: C50.2 R50.2 R52.2 R53.2 R54.2 R55.2 R56.2 U15.20(VCC)
+5V: C50.1 D13.2(K) D14.2(K) J33.1 J33.3 J33.4 J33.5 LD43.1(A) LD44.1(A) Q1.3 Q2.3 Q3.3 Q4.3 Q5.3 R61.1 R63.1 R65.1 R67.1 R69.1 U15.10(GND) U15.19(~{G})  [also labelled GND]
+12V: D12.2(K) J32.1 LD42.1(A) R64.1 R66.1 R68.1
+24V: D10.2(K) D11.2(K) J30.1 J31.1 LD40.1(A) LD41.1(A) R60.1 R62.1
CARD_SHUTTER: U15.15(B4) U43.2(K)
COIN_SHUTTER: U15.18(B1) U40.2(K)
DO_01: U15.2(A1)
DO_02: U15.3(A2)
DO_03: U15.4(A3)
DO_04: U15.5(A4)
DO_05: U15.6(B1)
RETURN_LAMP: U15.17(B2) U41.2(K)
NetD10_1: D10.1(A) J30.2 Q1.2 R73.1
NetD11_1: D11.1(A) J31.2 Q2.2 R74.1
NetD12_1: D12.1(A) J32.2 Q3.2 R75.1
NetD13_1: D13.1(A) J33.2 Q4.2 R76.1
NetD14_1: D14.1(A) J33.6 Q5.2 R77.1
NetLD40_2: LD40.2(K) R73.2
NetLD41_2: LD41.2(K) R74.2
NetLD42_2: LD42.2(K) R75.2
NetLD43_2: LD43.2(K) R76.2
NetLD44_2: LD44.2(K) R77.2
NetQ1_1: Q1.1 R61.2 U40.4(E)
NetQ2_1: Q2.1 R63.2 U41.4(E)
NetQ3_1: Q3.1 R65.2 U42.4(E)
NetQ4_1: Q4.1 R67.2 U43.4(E)
NetQ5_1: Q5.1 R69.2 U44.4(E)
NetR50_1: R50.1 U15.1(DIR)
NetR52_1: R52.1 U40.1(A)
NetR53_1: R53.1 U41.1(A)
NetR54_1: R54.1 U42.1(A)
NetR55_1: R55.1 U43.1(A)
NetR56_1: R56.1 U44.1(A)
NetR60_2: R60.2 U40.3(C)
NetR62_2: R62.2 U41.3(C)
NetR64_2: R64.2 U42.3(C)
NetR66_2: R66.2 U43.3(C)
NetR68_2: R68.2 U44.3(C)
NetU15_14: U15.14(B5) U44.2(K)
NetU15_16: U15.16(B3) U42.2(K)

Not connected (* = marked no-connect by the designer): U15 7(B2) 8(B3) 9(B4) 11(B8) 12(B7) 13(B6)

### Library data of the parts
C50 = Cap: Capacitor; Published: 8-Jun-2000; LatestRevisionDate: 17-Jul-2002; LatestRevisionNote: Re-released for DXP Platform.; Publisher: Altium Limited
LD40-LD44 = LED0: Typical INFRARED GaAs LED; Published: 8-Jun-2000; LatestRevisionDate: 17-Jul-2002; LatestRevisionNote: Re-released for DXP Platform.; Publisher: Altium Limited
R50 R52-R56 R60-R69 R73-R77 = Res3: Resistor; Published: 8-Jun-2000; LatestRevisionDate: 17-Jul-2002; LatestRevisionNote: Re-released for DXP Platform.; Publisher: Altium Limited
U40-U44 = Optoisolator1: Optoisolator; Published: 24-Mar-1999; LatestRevisionDate: 17-Jul-2002; LatestRevisionNote: Re-released for DXP Platform.; Publisher: Altium Limited

## Nets that join several sheets
+3.3V: 02-POWER DC-DC (5 pins), 03-CPU Core (38 pins), 04-lnterface1 (C51.2 U16.20), 05-lnterface2 (8 pins)
+5V: 01-POWER AC-DC (9 pins), 02-POWER DC-DC (33 pins), 03-CPU Core (38 pins), 04-lnterface1 (19 pins), 05-lnterface2 (21 pins)
+12V: 02-POWER DC-DC (C23.2 U13.1), 05-lnterface2 (6 pins)
+24V: 02-POWER DC-DC (10 pins), 05-lnterface2 (8 pins)
+VBUS: 01-POWER AC-DC (BR1.1 C57.1 C58.2), 02-POWER DC-DC (U18.1 U19.1)
DO_01: 03-CPU Core (U1.80), 05-lnterface2 (U15.2)
DO_02: 03-CPU Core (U1.79), 05-lnterface2 (U15.3)
DO_03: 03-CPU Core (U1.78), 05-lnterface2 (U15.4)
DO_04: 03-CPU Core (U1.77), 05-lnterface2 (U15.5)
DO_05: 03-CPU Core (U1.76), 05-lnterface2 (U15.6)
DO_09: 03-CPU Core (U1.72), 04-lnterface1 (U16.2)
DO_10: 03-CPU Core (U1.71), 04-lnterface1 (U16.3)
DO_11: 03-CPU Core (U1.70), 04-lnterface1 (U16.4)
DO_12: 03-CPU Core (U1.69), 04-lnterface1 (U16.5)
DO_13: 03-CPU Core (U1.68), 04-lnterface1 (U16.6)
DO_14: 03-CPU Core (U1.67), 04-lnterface1 (U16.7)
DO_15: 03-CPU Core (U1.66), 04-lnterface1 (U16.8)
DO_16: 03-CPU Core (U1.65), 04-lnterface1 (U16.9)